# EAGLE schematic Domino USB MicroSD (EAGLE 6.5.0)
DATABASE: ./BOM/Domino_DB.txt; DRAWN: M.STEMPIN; REV: A
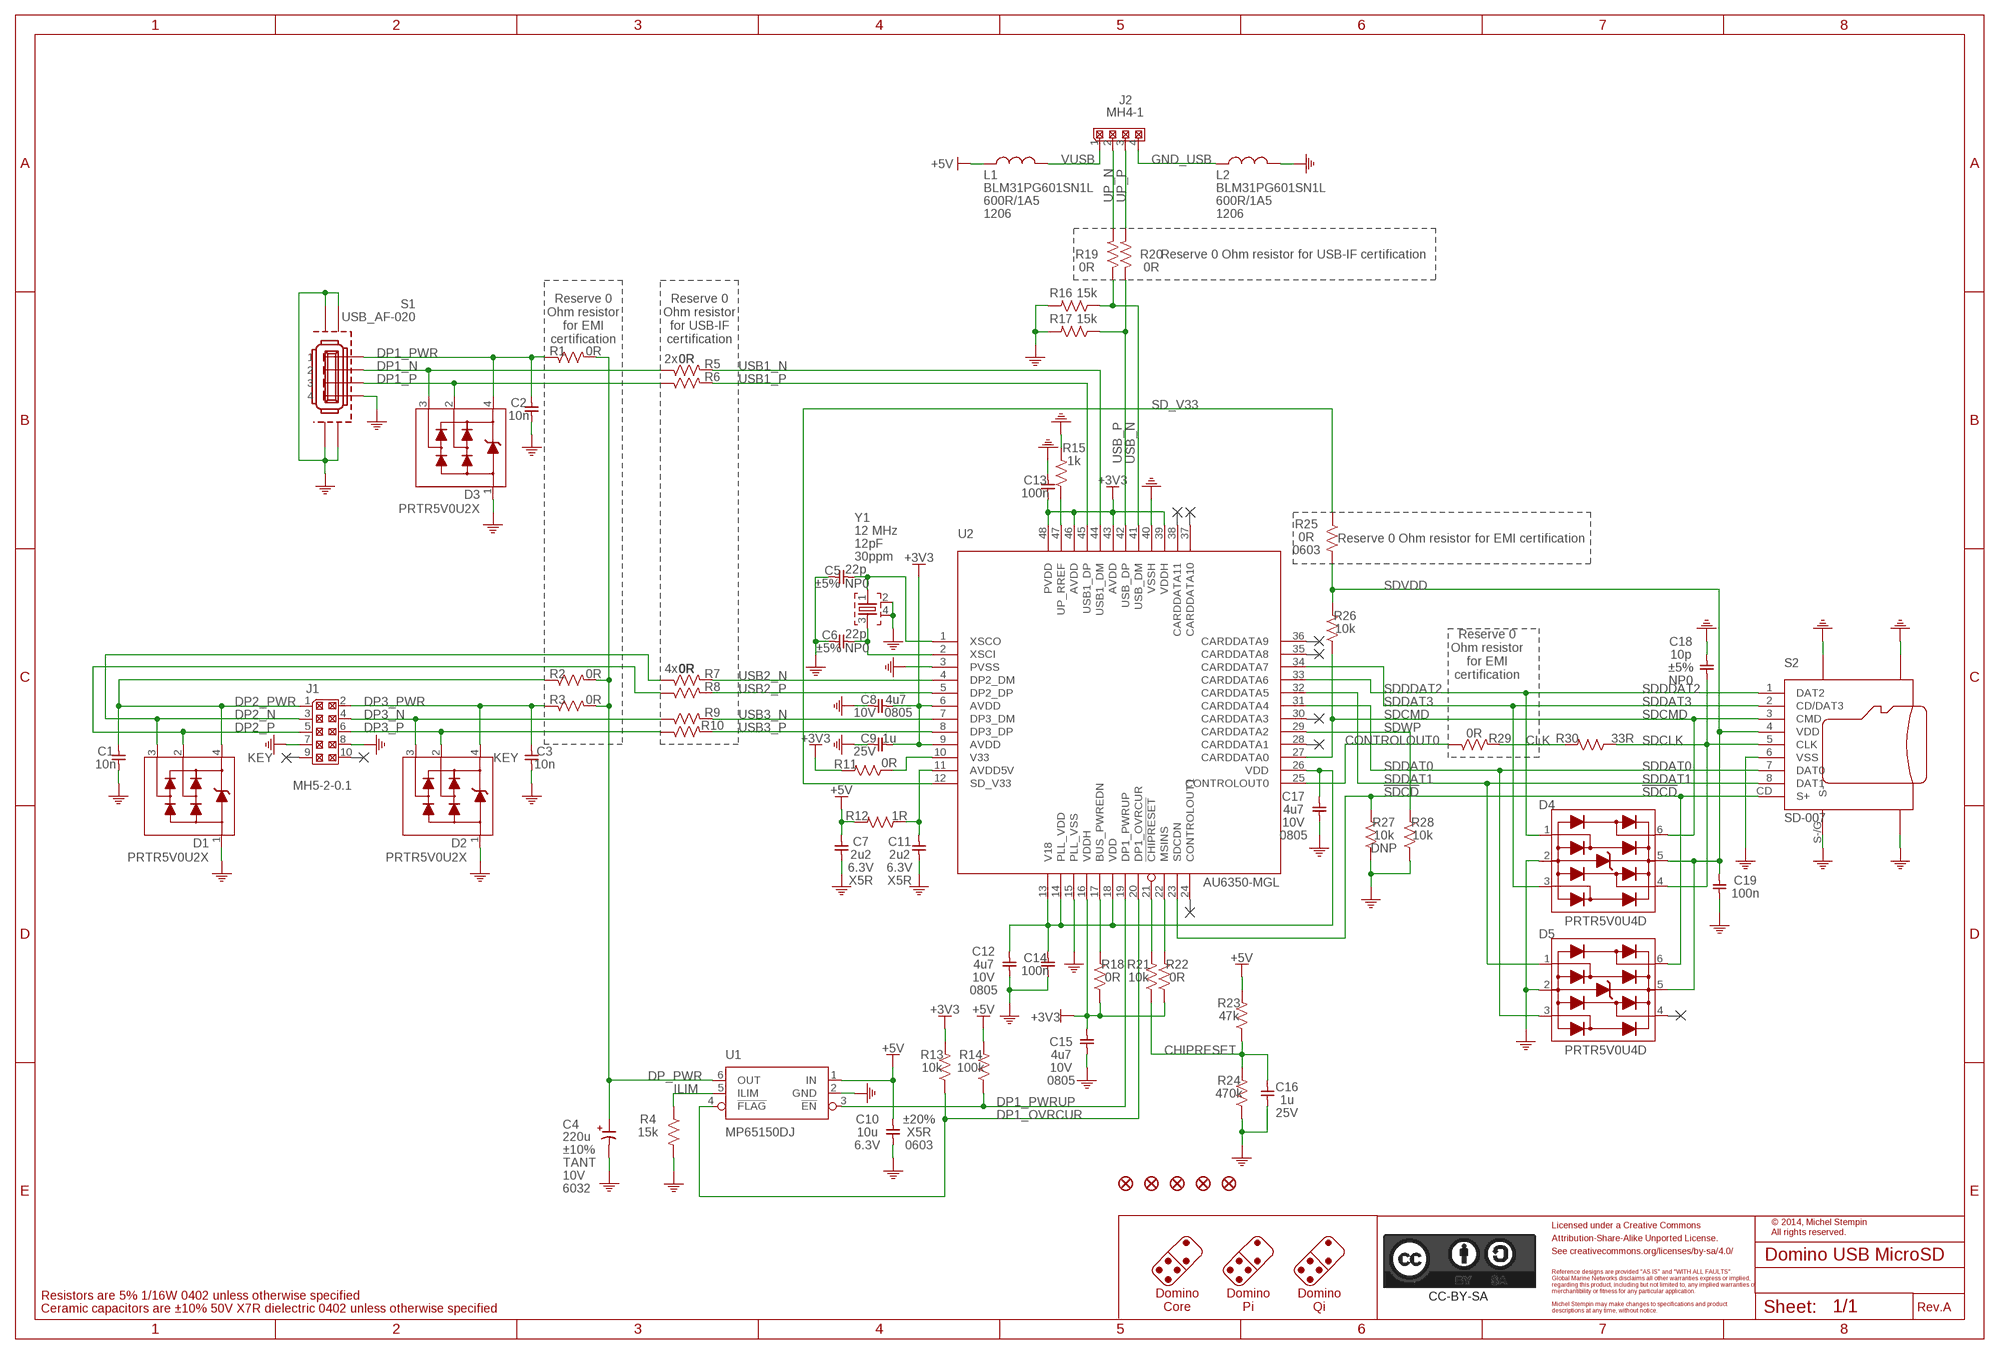
[diagram p0: schematic, sheet 1]
PORT1 (NC): BOM: EXCLUDE
PORT2 (NC): BOM: EXCLUDE
PORT3 (NC): BOM: EXCLUDE
PORT4 (NC): BOM: EXCLUDE
PORT5 (NC): BOM: EXCLUDE
PORT6 (NC): BOM: EXCLUDE
PORT7 (NC): BOM: EXCLUDE
PORT8 (NC): BOM: EXCLUDE
PORT9 (NC): BOM: EXCLUDE
PORT10 (NC): BOM: EXCLUDE

## Parts
C1  10n  CAP_0402  [C0402]
C2  10n  CAP_0402  [C0402]
C3  10n  CAP_0402  [C0402]
C4  220u  CPOL_C/6032-25  [C/6032-25]
C5  22p  CAP_0402  [C0402]
C6  22p  CAP_0402  [C0402]
C7  2u2  CAP_0402  [C0402]
C8  4u7  CAP_0805  [C0805]
C9  1u  CAP_0402  [C0402]
C10  10u  CAP_0603  [C0603]
C11  2u2  CAP_0402  [C0402]
C12  4u7  CAP_0805  [C0805]
C13  100n  CAP_0402  [C0402]
C14  100n  CAP_0402  [C0402]
C15  4u7  CAP_0805  [C0805]
C16  1u  CAP_0402  [C0402]
C17  4u7  CAP_0805  [C0805]
C18  10p  CAP_0402  [C0402]
C19  100n  CAP_0402  [C0402]
CC-BY-SA1  CC-BY-SA_LOGO  [CC-BY-SA_LOGO]
D1  PRTR5V0U2X  [SOT143B]
D2  PRTR5V0U2X  [SOT143B]
D3  PRTR5V0U2X  [SOT143B]
D4  PRTR5V0U4D  [SOT23-6]
D5  PRTR5V0U4D  [SOT23-6]
F1  FIDUCIAL  [FIDUCIAL]
F2  FIDUCIAL  [FIDUCIAL]
F4  FIDUCIAL  [FIDUCIAL]
F5  FIDUCIAL  [FIDUCIAL]
F6  FIDUCIAL  [FIDUCIAL]
J1  MH5-2-0.1  MH5-2  [MH05-2-0.1]
J2  MH4-1  [MH4-1-0.1]
L1  BLM31PG601SN1L  FB_1206  [FB1206]
L2  BLM31PG601SN1L  FB_1206  [FB1206]
R1  0R  RES_0402  [R0402]
R2  0R  RES_0402  [R0402]
R3  0R  RES_0402  [R0402]
R4  15k  RES_0402  [R0402]
R5  0R  RES_0402  [R0402]
R6  0R  RES_0402  [R0402]
R7  0R  RES_0402  [R0402]
R8  0R  RES_0402  [R0402]
R9  0R  RES_0402  [R0402]
R10  0R  RES_0402  [R0402]
R11  0R  RES_0402  [R0402]
R12  1R  RES_0402  [R0402]
R13  10k  RES_0402  [R0402]
R14  100k  RES_0402  [R0402]
R15  1k  RES_0402  [R0402]
R16  15k  RES_0402  [R0402]
R17  15k  RES_0402  [R0402]
R18  0R  RES_0402  [R0402]
R19  0R  RES_0402  [R0402]
R20  0R  RES_0402  [R0402]
R21  10k  RES_0402  [R0402]
R22  0R  RES_0402  [R0402]
R23  47k  RES_0402  [R0402]
R24  470k  RES_0402  [R0402]
R25  0R  RES_0603  [R0603]
R26  10k  RES_0402  [R0402]
R27  10k  RES_0402  [R0402]
R28  10k  RES_0402  [R0402]
R29  0R  RES_0402  [R0402]
R30  33R  RES_0402  [R0402]
S1  USB_AF-020  [USB_AF-020]
S2  SD-007  MICRO-SD  [SD-007]
U1  MP65150DJ  [SOT23-6]
U2  AU6350-MGL  [LQFP-48_7X7]
Y1  12 MHz  CRYSTAL_2SH  [CRYSTAL_32X25]

## Nets
!CHIPRESET: R21.2 U2.21(!CHIPRESET)
!SDCD: D5.6(I/O4) R27.2 S2.CD(S+) U2.23(SDCDN)
+3V3: C8.2 C9.2 C13.2 C15.2 R11.2 R13.2 R18.1 R22.1 U2.6(AVDD) U2.9(AVDD) U2.16(VDDH) U2.39(VDDH) U2.43(AVDD) U2.46(AVDD) U2.48(PVDD)
+5V: C7.1 C10.1 L1.2 R12.2 R14.2 R23.2 U1.1(IN)
AVDD5V: C11.1 R12.1 U2.11(AVDD5V)
BUS_PWREDN: R18.2 U2.17(BUS_PWREDN)
CHIPRESET: C16.1 R21.1 R23.1 R24.2
CLK: R29.2 R30.2
CONTROLOUT0: R29.1 U2.25(CONTROLOUT0)
DP1_N [USB]: D3.3 R5.1 S1.2
DP1_OVRCUR: R13.1 U1.4(!FLAG) U2.20(DP1_OVRCUR)
DP1_P [USB]: D3.2 R6.1 S1.3
DP1_PWR: C2.1 D3.4 R1.1 S1.1
DP1_PWRUP: R14.1 U1.3(!EN) U2.19(DP1_PWRUP)
DP2_N [USB]: D1.3 J1.3 R7.1
DP2_P [USB]: D1.2 J1.5 R8.1
DP2_PWR: C1.1 D1.4 J1.1 R2.1
DP3_N [USB]: D2.3 J1.4 R9.1
DP3_P [USB]: D2.2 J1.6 R10.1
DP3_PWR: C3.1 D2.4 J1.2 R3.1
DP_PWR: C4.1(+) R1.2 R2.2 R3.2 U1.6(OUT)
GND: C1.2 C2.2 C3.2 C4.2(-) C5.1 C6.1 C7.2 C8.1 C9.1 C10.2 C11.2 C12.1 C13.1 C14.2 C15.1 C16.2 C17.1 C18.2 C19.2 D1.1 D2.1 D3.1 D4.2(GND) D5.2(GND) J1.7 J1.8 L2.1 R4.2 R15.2 R16.2 R17.2 R24.1 R27.1 R28.1 S1.4 S1.G$1(G) S1.G$2(G) S1.G$3(G) S1.G$4(G) S2.6(VSS) S2.G$1(G) S2.G$2(G) S2.G$3(G) S2.S-/G(S-) U1.2(GND) U2.3(PVSS) U2.15(PLL_VSS) U2.40(VSSH) Y1.2 Y1.4
GND_USB: J2.4 L2.2
ILIM: R4.1 U1.5(ILIM)
MSINS: R22.2 U2.22(MSINS)
SD_V33: R25.1 U2.12(SD_V33)
SDCLK: C18.1 D4.4(I/O3) R30.1 S2.5(CLK)
SDCMD: D4.6(I/O4) R26.1 S2.3(CMD) U2.27(CARDDATA0)
SDDAT0: D5.3(I/O2) S2.7(DAT0) U2.31(CARDDATA4)
SDDAT1: D5.1(I/O1) S2.8(DAT1) U2.32(CARDDATA5)
SDDAT3: D4.3(I/O2) S2.2(CD/DAT3) U2.34(CARDDATA7)
SDDDAT2: D4.1(I/O1) S2.1(DAT2) U2.33(CARDDATA6)
SDVDD: C19.1 D4.5(VCC) D5.5(VCC) R25.2 R26.2 S2.4(VDD)
SDWP: R28.2 U2.29(CARDDATA2)
UP_N [USB]: J2.2 R19.2
UP_P [USB]: J2.3 R20.2
UP_PREF: R15.1 U2.47(UP_RREF)
USB1_N [USB]: R5.2 U2.44(USB1_DM)
USB1_P [USB]: R6.2 U2.45(USB1_DP)
USB2_N [USB]: R7.2 U2.4(DP2_DM)
USB2_P [USB]: R8.2 U2.5(DP2_DP)
USB3_N [USB]: R9.2 U2.7(DP3_DM)
USB3_P [USB]: R10.2 U2.8(DP3_DP)
USB_N [USB]: R16.1 R19.1 U2.41(USB_DM)
USB_P [USB]: R17.1 R20.1 U2.42(USB_DP)
V18: C12.2 C14.1 C17.2 U2.13(V18) U2.14(PLL_VDD) U2.18(VDD) U2.26(VDD)
V33: R11.1 U2.10(V33)
VUSB: J2.1 L1.1
XSCI: C6.2 U2.2(XSCI) Y1.3
XSCO: C5.2 U2.1(XSCO) Y1.1
Unconnected: D5.4(I/O3) J1.9 J1.10 U2.24(CONTROLOUT1) U2.28(CARDDATA1) U2.30(CARDDATA3) U2.35(CARDDATA8) U2.36(CARDDATA9) U2.37(CARDDATA10) U2.38(CARDDATA11)

## Notes on the sheet
- Reserve 0 Ohm resistor for USB-IF certification
- Reserve 0
  Ohm resistor
  for EMI
  certification
- Reserve 0
  Ohm resistor
  for USB-IF
  certification
- 2x
- Reserve 0 Ohm resistor for EMI certification
- Reserve 0
  Ohm resistor
  for EMI
  certification
- 4x
- KEY | KEY
- Licensed under a Creative Commons
- © 2014, Michel Stempin
  All rights reserved.
- Attribution-Share-Alike Unported License.
- See creativecommons.org/licenses/by-sa/4.0/
- Reference designs are provided "AS IS" and "WITH ALL FAULTS".
- Global Marine Networks disclaims all other warranties express or implied,
- regarding this product, including but not limited to, any implied warranties of
- merchantibility or fitness for any particular application.
- Resistors are 5% 1/16W 0402 unless otherwise specified
- Domino
  Core
- Domino
  Pi
- Domino
  Qi
- Michel Stempin may make changes to specifications and product
- Ceramic capacitors are ±10% 50V X7R dielectric 0402 unless otherwise specified | descriptions at any time, without notice. | Rev.

## Library data of the parts
C1-C3 = Domino:CAP_: Capacitor; PARTNO: C0402_10n_X7R_10%_CER_50V; SIZE: 0402; TC: X7R; TOL: ±10%; TYPE: CER; VOLT: 50V
C4 = Domino:CPOL_?*: Polarized Capacitor; PARTNO: CPOLC-6032_220u_20%_TANT_10V; SIZE: 6032; TOL: ±10%; TYPE: TANT; VOLT: 10V
C5 C6 = Domino:CAP_: Capacitor; PARTNO: C0402_22p_NP0_5%_CER_50V; SIZE: 0402; TC: NP0; TOL: ±5%; TYPE: CER; VOLT: 50V
C7 C11 = Domino:CAP_: Capacitor; PARTNO: C0402_2u2_X5R_10%_CER_6V3; SIZE: 0402; TC: X5R; TOL: ±10%; TYPE: CER; VOLT: 6.3V
C8 C12 C15 C17 = Domino:CAP_: Capacitor; PARTNO: C0805_4u7_X7R_10%_CER_6V3; SIZE: 0805; TC: X7R; TOL: 10%; TYPE: CER; VOLT: 10V
C9 C16 = Domino:CAP_: Capacitor; PARTNO: C0402_1u_X7R_10%_CER_25V; SIZE: 0402; TC: X7R; TOL: ±10%; TYPE: CER; VOLT: 25V
C10 = Domino:CAP_: Capacitor; PARTNO: C0603_10u_X5R_20%_CER_6V3; SIZE: 0603; TC: X5R; TOL: ±20%; TYPE: CER; VOLT: 6.3V
C13 C14 C19 = Domino:CAP_: Capacitor; PARTNO: C0402_100n_X7R_10%_CER_50V; SIZE: 0402; TC: X7R; TOL: ±10%; TYPE: CER; VOLT: 50V
C18 = Domino:CAP_: Capacitor; PARTNO: C0402_10p_NP0_5%_CER_50V; SIZE: 0402; TC: NP0; TOL: ±5%; TYPE: CER; VOLT: 50V
CC-BY-SA1 = Domino:CC-BY-SA_LOGO: Attribution-Share-Alike Unported License See creativecommons.org/licenses/by-sa/3.0/ for details.; BOM: EXCLUDE
D1-D3 = Domino:PRTR5V0U2X: Ultra low capacitance double rail-to-rail ESD protection diode; PARTNO: PRTR5V0U2X
D4 D5 = Domino:PRTR5V0U4D: Ultra low capacitance quadruple rail-to-rail ESD protection; PARTNO: PRTR5V0U4D
F1 F2 F4-F6 = Domino:FIDUCIAL: Fiducial Mark Copyright © 2012, Michel Stempin, All rights reserved Licenced under Creative Commons CC BY-SA 3.0 <http://creativecommons.org/licenses/by-sa/3.0/deed.en> license.; BOM: EXCLUDE
J1 = Domino:MH5-2: 2x5 Pin Male Header; PARTNO: MH5-2-0.1
J2 = Domino:MH4-1: 4x1 Pin Male Header; PARTNO: MH4-1-0.1
L1 L2 = Domino:FB_: Ferrite Bead; OPT: 600R/1A5; PARTNO: BLM31PG601SN1L; SIZE: 1206
R1-R3 R5-R10 R18-R20 R22 R29 = Domino:RES_: Resistor; PARTNO: R0402_0R_5%_62.5mW; RATE: 62.5mW; SIZE: 0402; TOL: 5%
R4 R16 R17 = Domino:RES_: Resistor; PARTNO: R0402_15k_5%_62.5mW; RATE: 62.5mW; SIZE: 0402; TOL: 5%
R11 = Domino:RES_: Resistor; PARTNO: R0402_0R_5%_62.5mW; RATE: 125mW; SIZE: 0402; TOL: 5%
R12 = Domino:RES_: Resistor; PARTNO: R0402_1R_5%_62.5mW; RATE: 62.5mW; SIZE: 0402; TOL: 5%
R13 R21 R26 R28 = Domino:RES_: Resistor; PARTNO: R0402_10k_5%_62.5mW; RATE: 62.5mW; SIZE: 0402; TOL: 5%
R14 = Domino:RES_: Resistor; PARTNO: R0402_100k_5%_62.5mW; RATE: 62.5mW; SIZE: 0402; TOL: 5%
R15 = Domino:RES_: Resistor; PARTNO: R0402_1k_5%_62.5mW; RATE: 62.5mW; SIZE: 0402; TOL: 5%
R23 = Domino:RES_: Resistor; PARTNO: R0402_47k_5%_62.5mW; RATE: 62.5mW; SIZE: 0402; TOL: 5%
R24 = Domino:RES_: Resistor; PARTNO: R0402_470k_5%_62.5mW; RATE: 62.5mW; SIZE: 0402; TOL: 5%
R25 = Domino:RES_: Resistor; PARTNO: R0603_0R_5%_125mW; RATE: 125mW; SIZE: 0603; TOL: 5%
R27 = Domino:RES_: Resistor; DNP: T; PARTNO: R0402_10k_5%_62.5mW; RATE: 62.5mW; SIZE: 0402; TOL: 5%
R30 = Domino:RES_: Resistor; PARTNO: R0402_33R_5%_62.5mW; RATE: 62.5mW; SIZE: 0402; TOL: 5%
S1 = Domino:USB_AF-020: USB Type A Socket; PARTNO: USB_AF-020
S2 = Domino:MICRO-SD: Micro SD Memory Card Connector, With Card Detect Switch; PARTNO: SD-007
U1 = Domino:MP65150DJ: Precision 60mA-1.7A Programmable Current-Limited Power Distribution Switch; PARTNO: MP65150DJ
U2 = Domino:AU6350-MGL: USB2.0 Hub-Reader Controller; PARTNO: AU6350-MGL
Y1 = Domino:CRYSTAL_2SH: Crystal with 2 Shield Pins; LOAD: 12pF; PARTNO: CRYSTAL_32X25_2SH_12PF_30PPM; TOL: 30ppm

## Net classes
1 USB: width 0.368 mm, clearance 0.152 mm to class 0, clearance 0.152 mm
2 PoE: width 0.61 mm, clearance 0.13 mm to class 0, clearance 0.13 mm to class 1, clearance 0.13 mm